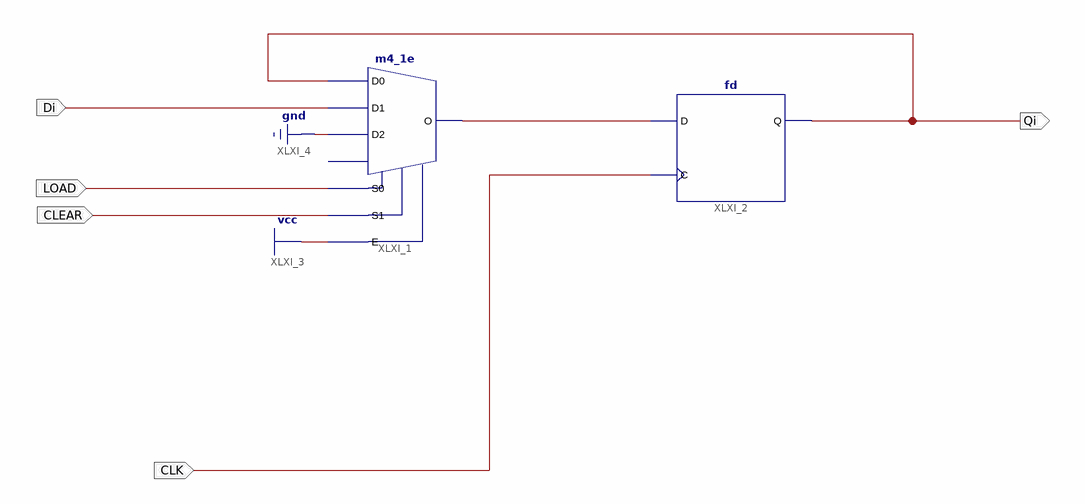
[diagram p0: schematic sheet 1]
// Xilinx ISE schematic REGi.sch (spartan3e) as structural Verilog: 2 symbols, 5 ports
module REGi (
  input  CLK,
  input  CLEAR,
  input  LOAD,
  input  Di,
  output Qi
);

  wire XLXN_1;

  m4_1e XLXI_1 (.D0(Qi), .D1(Di), .D2(1'b0), .E(1'b1), .S0(LOAD), .S1(CLEAR), .O(XLXN_1));  // open: D3
  fd XLXI_2 (.C(CLK), .D(XLXN_1), .Q(Qi));
endmodule
